# Altium schematic sheet UWB_board.SchDoc: Top view
size A4; Author: Jan Jiří Bauer; DrawnBy: Jan Jiří Bauer; Revision: 1.1; SheetNumber: 1; SheetTotal: 9
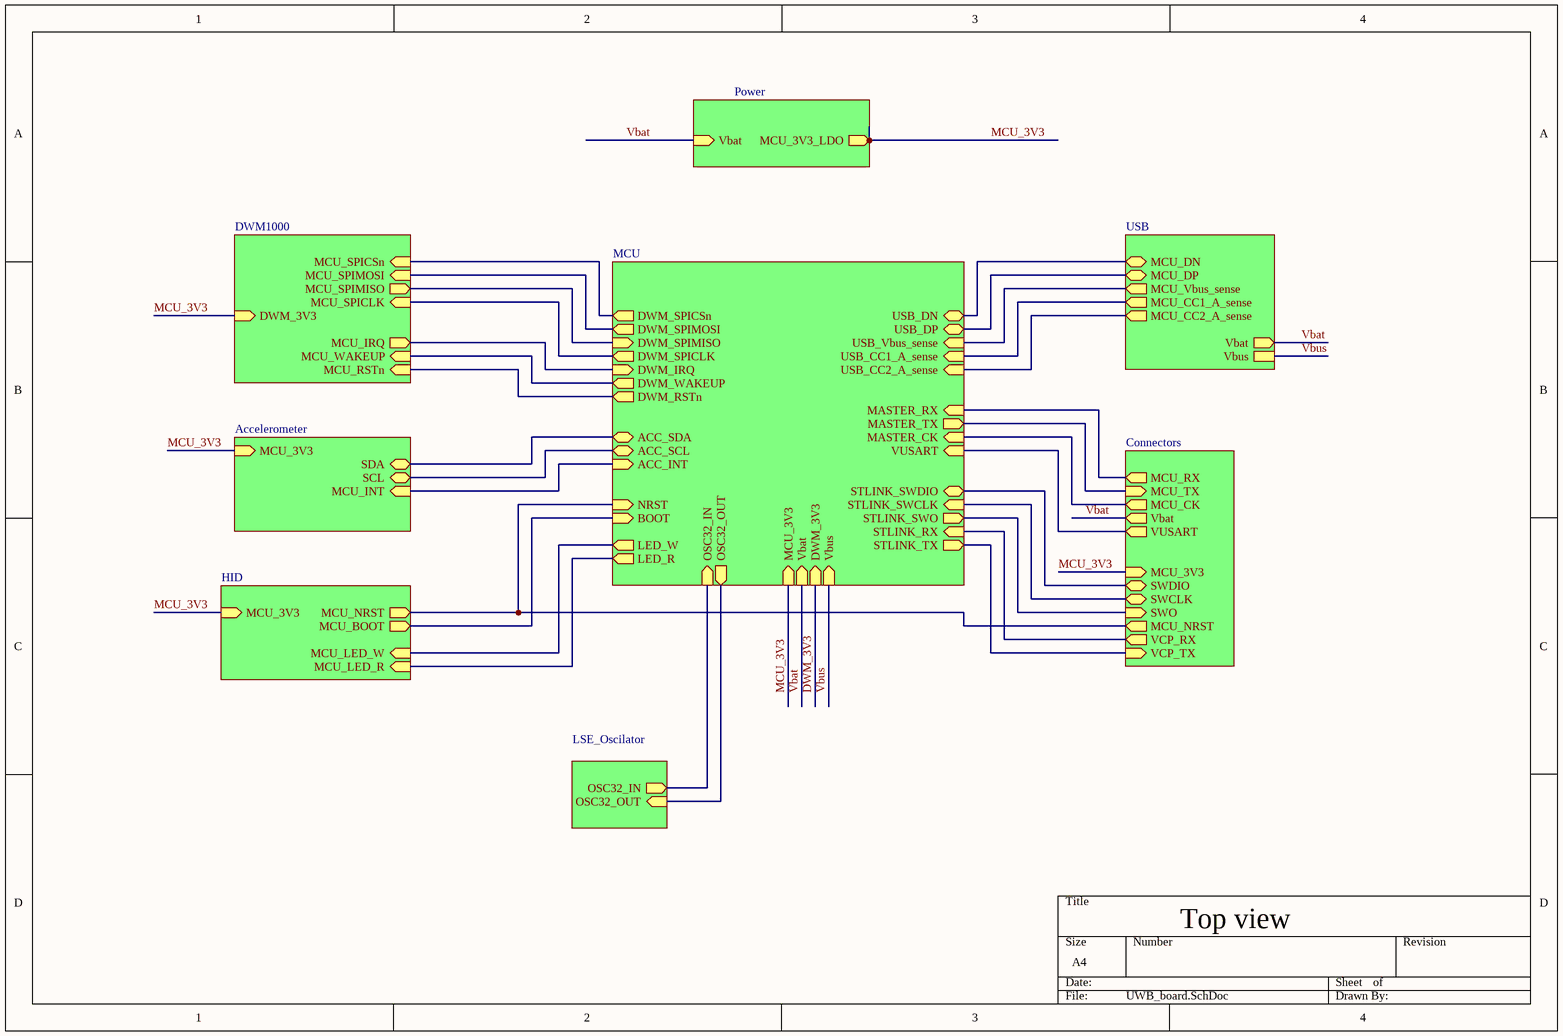
[diagram p0: UWB_board.SchDoc]

## Sub-sheets
? = MCU: DWM_SPICSn (out), DWM_SPIMOSI (out), DWM_SPIMISO (in), DWM_SPICLK (out), DWM_IRQ (in), DWM_WAKEUP (out), DWM_RSTn (out), USB_DN (bidir), USB_DP (bidir), USB_Vbus_sense (in), USB_CC1_A_sense (in), USB_CC2_A_sense (in), MASTER_RX (in), MASTER_TX (out), MASTER_CK (in), VUSART (in), STLINK_SWDIO (bidir), STLINK_SWCLK (in), NRST (in), STLINK_RX (in), STLINK_TX (out), ACC_SDA (bidir), ACC_SCL (bidir), ACC_INT (in), BOOT (in), OSC32_IN (in), OSC32_OUT (out), MCU_3V3 (in), Vbat (in), DWM_3V3 (in), Vbus (in), STLINK_SWO (out), LED_W (out), LED_R (out)
? = Power: MCU_3V3_LDO (out), Vbat (in)
? = LSE_Oscilator: OSC32_IN (out), OSC32_OUT (in)
? = USB: MCU_DP (bidir), MCU_DN (bidir), MCU_CC1_A_sense (out), MCU_CC2_A_sense (out), MCU_Vbus_sense (out), Vbat (out), Vbus
? = Connectors: MCU_TX (in), MCU_RX (out), MCU_CK (out), Vbat (out), VUSART (out), MCU_3V3 (in), SWDIO (bidir), SWCLK (bidir), MCU_NRST (out), VCP_TX (in), VCP_RX (out), SWO (in)
? = HID: MCU_3V3 (in), MCU_NRST (out), MCU_BOOT (out), MCU_LED_R (in), MCU_LED_W (in)
? = DWM1000: MCU_SPICSn (in), MCU_SPIMOSI (in), MCU_SPIMISO (out), MCU_SPICLK (in), DWM_3V3 (in), MCU_IRQ (out), MCU_WAKEUP (in), MCU_RSTn (in)
? = Accelerometer: MCU_3V3 (in), SDA (bidir), SCL (bidir), MCU_INT (in)

## Nets
DWM_3V3: sheet /DWM_3V3
MCU_3V3: sheet /MCU_3V3, sheet /MCU_3V3_LDO, sheet /MCU_3V3, sheet /MCU_3V3, sheet /DWM_3V3, sheet /MCU_3V3
Vbat: sheet /Vbat, sheet /Vbat, sheet /Vbat, sheet /Vbat
Vbus: sheet /Vbus, sheet /Vbus
(unnamed): sheet /DWM_SPICSn, sheet /MCU_SPICSn
(unnamed): sheet /DWM_SPIMOSI, sheet /MCU_SPIMOSI
(unnamed): sheet /DWM_SPIMISO, sheet /MCU_SPIMISO
(unnamed): sheet /DWM_SPICLK, sheet /MCU_SPICLK
(unnamed): sheet /DWM_IRQ, sheet /MCU_IRQ
(unnamed): sheet /DWM_WAKEUP, sheet /MCU_WAKEUP
(unnamed): sheet /DWM_RSTn, sheet /MCU_RSTn
(unnamed): sheet /USB_DN, sheet /MCU_DN
(unnamed): sheet /USB_DP, sheet /MCU_DP
(unnamed): sheet /USB_Vbus_sense, sheet /MCU_Vbus_sense
(unnamed): sheet /USB_CC1_A_sense, sheet /MCU_CC1_A_sense
(unnamed): sheet /USB_CC2_A_sense, sheet /MCU_CC2_A_sense
(unnamed): sheet /MASTER_RX, sheet /MCU_RX
(unnamed): sheet /MASTER_TX, sheet /MCU_TX
(unnamed): sheet /MASTER_CK, sheet /MCU_CK
(unnamed): sheet /VUSART, sheet /VUSART
(unnamed): sheet /STLINK_SWDIO, sheet /SWDIO
(unnamed): sheet /STLINK_SWCLK, sheet /SWCLK
(unnamed): sheet /NRST, sheet /MCU_NRST, sheet /MCU_NRST
(unnamed): sheet /STLINK_RX, sheet /VCP_RX
(unnamed): sheet /STLINK_TX, sheet /VCP_TX
(unnamed): sheet /ACC_SDA, sheet /SDA
(unnamed): sheet /ACC_SCL, sheet /SCL
(unnamed): sheet /ACC_INT, sheet /MCU_INT
(unnamed): sheet /BOOT, sheet /MCU_BOOT
(unnamed): sheet /OSC32_IN, sheet /OSC32_IN
(unnamed): sheet /OSC32_OUT, sheet /OSC32_OUT
(unnamed): sheet /STLINK_SWO, sheet /SWO
(unnamed): sheet /LED_W, sheet /MCU_LED_W
(unnamed): sheet /LED_R, sheet /MCU_LED_R

## Notes on the sheet
- Top view